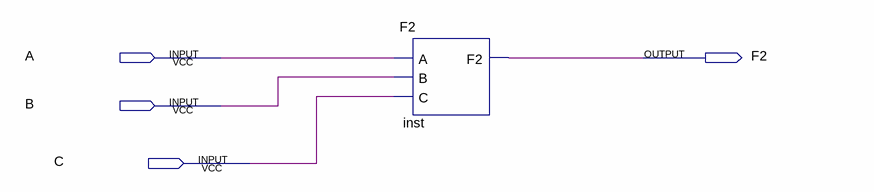
[diagram p0: schematic sheet]
// Quartus schematic Dong goi F2.bdf as structural Verilog: 1 symbols, 4 pins
module \Dong_goi_F2  (
  input  A,
  input  B,
  input  C,
  output F2
);

  F2 inst (.A(A), .B(B), .C(C), .F2(F2));
endmodule
